# Altium schematic sheet DfMUX_Transceiver.SchDoc: Digital fMUX Mezzanine - Transceiver
size 246 x 182 mm; Engineer: M.Dobbs, McGill U.; Revision: 4
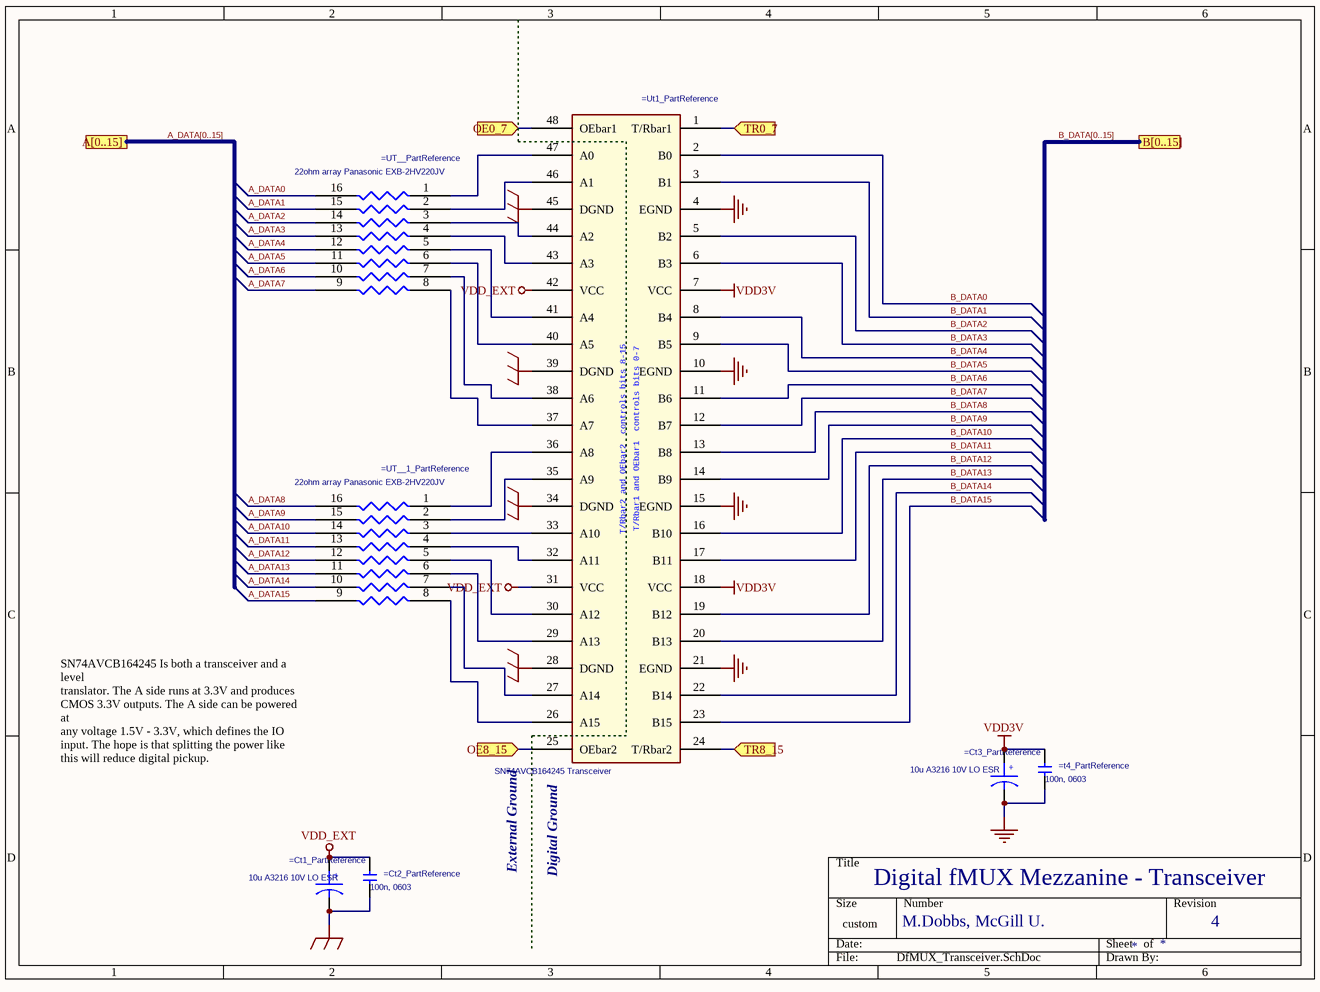
[diagram p0: DfMUX_Transceiver.SchDoc]

## Parts
=Ct1_PartReference  10u A3216 10V LO ESR  [TANTA]
=Ct2_PartReference  100n, 0603  [0603C]
=Ct3_PartReference  10u A3216 10V LO ESR  [TANTA]
=t4_PartReference  100n, 0603  [0603C]
=Ut1_PartReference  SN74AVCB164245 Transceiver  [TSSOP48_.4MMPITCH_NARROW]
=UT__1_PartReference  22ohm array Panasonic EXB-2HV220JV  [RN8.150X63]
=UT__PartReference  22ohm array Panasonic EXB-2HV220JV  [RN8.150X63]

## Ports
A[0..15], B[0..15], OE0_7, OE8_15, TR0_7, TR8_15

## Nets
GND_DIG: =Ct3_PartReference.2 =t4_PartReference.1 =Ut1_PartReference.4(EGND) =Ut1_PartReference.10(EGND) =Ut1_PartReference.15(EGND) =Ut1_PartReference.21(EGND)
GND_EARTH: =Ct1_PartReference.2 =Ct2_PartReference.1 =Ut1_PartReference.28(DGND) =Ut1_PartReference.34(DGND) =Ut1_PartReference.39(DGND) =Ut1_PartReference.45(DGND)
VDD3V: =Ct3_PartReference.1 =t4_PartReference.2 =Ut1_PartReference.7(VCC) =Ut1_PartReference.18(VCC)
VDD_EXT: =Ct1_PartReference.1 =Ct2_PartReference.2 =Ut1_PartReference.31(VCC) =Ut1_PartReference.42(VCC)
A_DATA0: =UT__PartReference.16(R1)
A_DATA1: =UT__PartReference.15(R2)
A_DATA2: =UT__PartReference.14(R3)
A_DATA3: =UT__PartReference.13(R4)
A_DATA4: =UT__PartReference.12(R5)
A_DATA5: =UT__PartReference.11(R6)
A_DATA6: =UT__PartReference.10(R7)
A_DATA7: =UT__PartReference.9(R8)
A_DATA8: =UT__1_PartReference.16(R1)
A_DATA9: =UT__1_PartReference.15(R2)
A_DATA10: =UT__1_PartReference.14(R3)
A_DATA11: =UT__1_PartReference.13(R4)
A_DATA12: =UT__1_PartReference.12(R5)
A_DATA13: =UT__1_PartReference.11(R6)
A_DATA14: =UT__1_PartReference.10(R7)
A_DATA15: =UT__1_PartReference.9(R8)
B_DATA0: =Ut1_PartReference.2(B0)
B_DATA1: =Ut1_PartReference.3(B1)
B_DATA2: =Ut1_PartReference.5(B2)
B_DATA3: =Ut1_PartReference.6(B3)
B_DATA4: =Ut1_PartReference.8(B4)
B_DATA5: =Ut1_PartReference.9(B5)
B_DATA6: =Ut1_PartReference.11(B6)
B_DATA7: =Ut1_PartReference.12(B7)
B_DATA8: =Ut1_PartReference.13(B8)
B_DATA9: =Ut1_PartReference.14(B9)
B_DATA10: =Ut1_PartReference.16(B10)
B_DATA11: =Ut1_PartReference.17(B11)
B_DATA12: =Ut1_PartReference.19(B12)
B_DATA13: =Ut1_PartReference.20(B13)
B_DATA14: =Ut1_PartReference.22(B14)
B_DATA15: =Ut1_PartReference.23(B15)
OE0_7: =Ut1_PartReference.48(OEbar1) ; port OE0_7
OE8_15: =Ut1_PartReference.25(OEbar2) ; port OE8_15
TR0_7: =Ut1_PartReference.1(T/Rbar1) ; port TR0_7
TR8_15: =Ut1_PartReference.24(T/Rbar2) ; port TR8_15
Net=Ut1_PartReference_26: =Ut1_PartReference.26(A15) =UT__1_PartReference.8(R8)
Net=Ut1_PartReference_27: =Ut1_PartReference.27(A14) =UT__1_PartReference.7(R7)
Net=Ut1_PartReference_29: =Ut1_PartReference.29(A13) =UT__1_PartReference.6(R6)
Net=Ut1_PartReference_30: =Ut1_PartReference.30(A12) =UT__1_PartReference.5(R5)
Net=Ut1_PartReference_32: =Ut1_PartReference.32(A11) =UT__1_PartReference.4(R4)
Net=Ut1_PartReference_33: =Ut1_PartReference.33(A10) =UT__1_PartReference.3(R3)
Net=Ut1_PartReference_35: =Ut1_PartReference.35(A9) =UT__1_PartReference.2(R2)
Net=Ut1_PartReference_36: =Ut1_PartReference.36(A8) =UT__1_PartReference.1(R1)
Net=Ut1_PartReference_37: =Ut1_PartReference.37(A7) =UT__PartReference.8(R8)
Net=Ut1_PartReference_38: =Ut1_PartReference.38(A6) =UT__PartReference.7(R7)
Net=Ut1_PartReference_40: =Ut1_PartReference.40(A5) =UT__PartReference.6(R6)
Net=Ut1_PartReference_41: =Ut1_PartReference.41(A4) =UT__PartReference.5(R5)
Net=Ut1_PartReference_43: =Ut1_PartReference.43(A3) =UT__PartReference.4(R4)
Net=Ut1_PartReference_44: =Ut1_PartReference.44(A2) =UT__PartReference.3(R3)
Net=Ut1_PartReference_46: =Ut1_PartReference.46(A1) =UT__PartReference.2(R2)
Net=Ut1_PartReference_47: =Ut1_PartReference.47(A0) =UT__PartReference.1(R1)

## Buses and harness runs
bus A_DATA[0..15] = port A[0..15]
bus B_DATA[0..15] = port B[0..15]

## Notes on the sheet
- SN74AVCB164245 Is both a transceiver and a level
  translator. The A side runs at 3.3V and produces
  CMOS 3.3V outputs. The A side can be powered at
  any voltage 1.5V - 3.3V, which defines the IO
  input. The hope is that splitting the power like
  this will reduce digital pickup.
- (near =Ut1_PartReference) External Ground
- (near =Ut1_PartReference) Digital Ground
- (in symbol 74LVT16245 Transceiver_0) T/Rbar2 and OEbar2  controls bits 8-15; T/Rbar1 and OEbar1  controls bits 0-7
- (in symbol CAPACITOR POL) +

## Library data of the parts
=Ct1_PartReference =Ct3_PartReference = CAPACITOR POL: COMPFIXED: NO; COMPGROUP: 0; COMPHEIGHT: 0.000; COMPROT: 270; COMPSIDE: TOP; COMPKEY: NO; COMPLOCKED: NO; DECOUPLER: NO; MEMORY: NO
  =Ct1_PartReference: COMPLOC: =Ct1_COMPLOC
  =Ct3_PartReference: COMPLOC: =Ct3_COMPLOC
=Ct2_PartReference = C: PSpiceTemplate: C^@REFDES %1 %2 ?TOLERANCE|C^@REFDES| @VALUE ?IC/IC=@IC/ ?TOLERANCE|\n.model C^@REFDES CAP C=1 DEV=@TOLERANCE%|; COMPFIXED: NO; COMPGROUP: 0; COMPHEIGHT: 0.000; COMPSIDE: TOP; Value: 100n, 0603; COMPKEY: NO; COMPLOCKED: NO; COMPROT: 0; DECOUPLER: NO; MEMORY: NO; COMPLOC: =Ct2_COMPLOC
=t4_PartReference = C: PSpiceTemplate: C^@REFDES %1 %2 ?TOLERANCE|C^@REFDES| @VALUE ?IC/IC=@IC/ ?TOLERANCE|\n.model C^@REFDES CAP C=1 DEV=@TOLERANCE%|; COMPFIXED: NO; COMPGROUP: 0; COMPHEIGHT: 0.000; COMPROT: 90; COMPSIDE: TOP; Value: 100n, 0603; COMPKEY: NO; COMPLOCKED: NO; DECOUPLER: NO; MEMORY: NO; COMPLOC: =t4_COMPLOC
=Ut1_PartReference = 74LVT16245 Transceiver_0: COMPFIXED: NO; COMPGROUP: 0; COMPHEIGHT: 0.000; COMPROT: 90; COMPSIDE: BOT; FPLIST: TSSOP48_.4MMPITCH,TSSOP48_.4MMPITCH_NARROW; COMPKEY: NO; COMPLOCKED: NO; DECOUPLER: NO; MEMORY: NO; COMPLOC: =Ut1_COMPLOC
=UT__1_PartReference =UT__PartReference = R-PACK: COMPFIXED: NO; COMPGROUP: 0; COMPHEIGHT: 0.000; COMPROT: 90; COMPSIDE: BOT; COMPKEY: NO; COMPLOCKED: NO; DECOUPLER: NO; MEMORY: NO
  =UT__1_PartReference: COMPLOC: =UT__1_COMPLOC
  =UT__PartReference: COMPLOC: =UT__COMPLOC